# EAGLE design DrMcn (EAGLE 8.2.2)

## Sheet 1 of 2: power
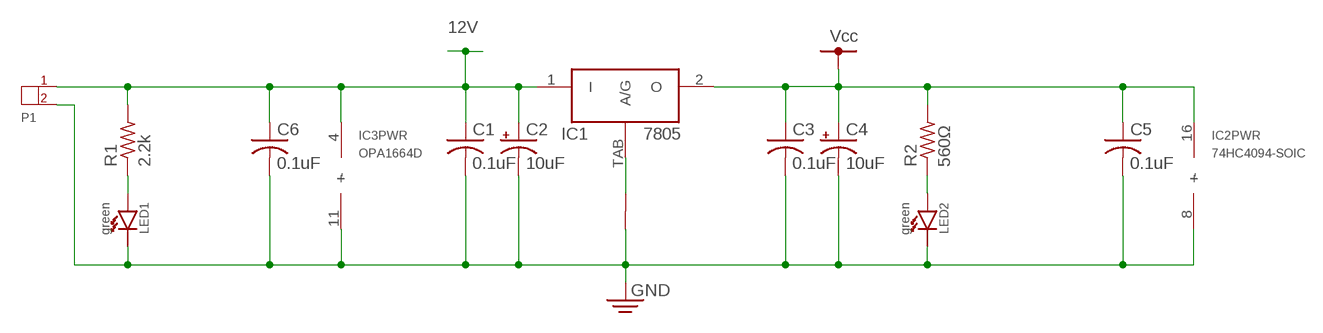
[diagram p0: schematic, sheet 1]

### Parts
-1  SEPERATOR  [SEPERATOR]
C1  0.1uF  C-USC0805  [C0805]
C2  10uF  CPOL-USE5-10.5  [E5-10,5]
C3  0.1uF  C-USC0805  [C0805]
C4  10uF  CPOL-USE5-10.5  [E5-10,5]
C5  0.1uF  C-USC0805  [C0805]
C6  0.1uF  C-USC0805  [C0805]
IC1  7805  [TO-252]
IC2  74HC4094-SOIC  [16-SOIC]
IC3  OPA1664D  [14-SOP]
LED1  green  LG_Q971  [0603-LED]
LED2  green  LG_Q971  [0603-LED]
P1  CONN-2P-VL  [B02P-VL]
R1  2.2k  R-US_R0805  [R0805]
R2  560Ω  R-US_R0603  [R0603]

### Nets
12V [mm]: C1.1 C2.+ C6.1 IC1.1(I) IC3.4(PWR:+) P1.1 R1.2 ; also sheet 2
GND: -1.P$1 C1.2 C2.- C3.2 C4.- C5.2 C6.2 IC2.8(PWR:-) IC3.11(PWR:-) LED1.C LED2.C P1.2 ; also sheet 2
N$1: LED2.A R2.1
N$2: LED1.A R1.1
TAB: -1.P$2 IC1.TAB(A/G)
VCC [Vcc]: C3.1 C4.+ C5.1 IC1.2(O) IC2.16(PWR:+) R2.2 ; also sheet 2

## Sheet 2 of 2: control
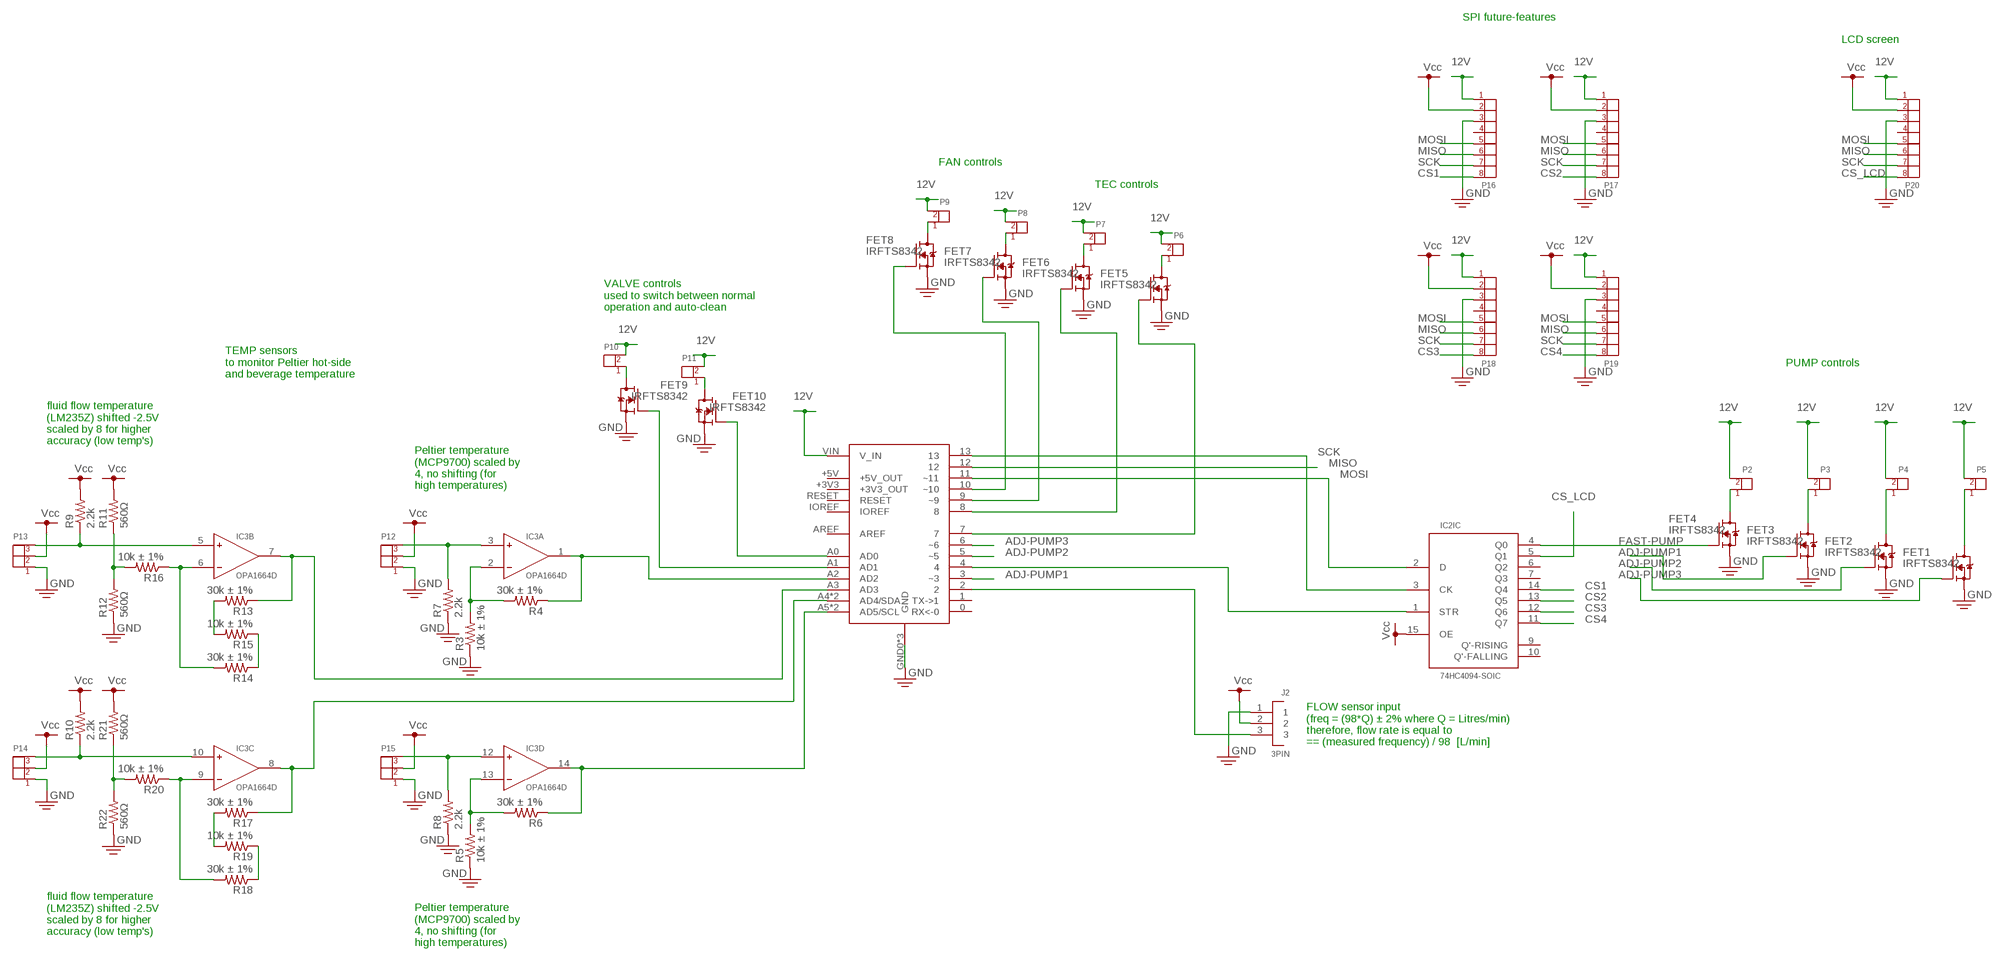
[diagram p1: schematic, sheet 2]

### Parts
FET1  IRFTS8342  [SOT23-6]
FET2  IRFTS8342  [SOT23-6]
FET3  IRFTS8342  [SOT23-6]
FET4  IRFTS8342  [SOT23-6]
FET5  IRFTS8342  [SOT23-6]
FET6  IRFTS8342  [SOT23-6]
FET7  IRFTS8342  [SOT23-6]
FET8  IRFTS8342  [SOT23-6]
FET9  IRFTS8342  [SOT23-6]
FET10  IRFTS8342  [SOT23-6]
J1  ARDUINO_UNO  [ARDUINO_UNO]
J2  3PIN  [3P]
P2  CONN-2P-PNI  [B02B-PNISK]
P3  CONN-2P-PNI  [B02B-PNISK]
P4  CONN-2P-PNI  [B02B-PNISK]
P5  CONN-2P-PNI  [B02B-PNISK]
P6  CONN-2P-VL  [B02P-VL]
P7  CONN-2P-VL  [B02P-VL]
P8  CONN-2P-PNI  [B02B-PNISK]
P9  CONN-2P-PNI  [B02B-PNISK]
P10  CONN-2P-PNI  [B02B-PNISK]
P11  CONN-2P-PNI  [B02B-PNISK]
P12  CONN-3P-PNI  [B03B-PNISK]
P13  CONN-3P-PNI  [B03B-PNISK]
P14  CONN-3P-PNI  [B03B-PNISK]
P15  CONN-3P-PNI  [B03B-PNISK]
P16  CONN-8P-PND  [B08B-PND]
P17  CONN-8P-PND  [B08B-PND]
P18  CONN-8P-PND  [B08B-PND]
P19  CONN-8P-PND  [B08B-PND]
P20  CONN-8P-PND  [B08B-PND]
R3  10k ± 1%  R-US_R0603  [R0603]
R4  30k ± 1%  R-US_R0603  [R0603]
R5  10k ± 1%  R-US_R0603  [R0603]
R6  30k ± 1%  R-US_R0603  [R0603]
R7  2.2k  R-US_R0603  [R0603]
R8  2.2k  R-US_R0603  [R0603]
R9  2.2k  R-US_R0603  [R0603]
R10  2.2k  R-US_R0603  [R0603]
R11  560Ω  R-US_R0603  [R0603]
R12  560Ω  R-US_R0603  [R0603]
R13  30k ± 1%  R-US_R0603  [R0603]
R14  30k ± 1%  R-US_R0603  [R0603]
R15  10k ± 1%  R-US_R0603  [R0603]
R16  10k ± 1%  R-US_R0603  [R0603]
R17  30k ± 1%  R-US_R0603  [R0603]
R18  30k ± 1%  R-US_R0603  [R0603]
R19  10k ± 1%  R-US_R0603  [R0603]
R20  10k ± 1%  R-US_R0603  [R0603]
R21  560Ω  R-US_R0603  [R0603]
R22  560Ω  R-US_R0603  [R0603]

### Nets
12V [mm]: J1.VIN(V_IN) P2.2 P3.2 P4.2 P5.2 P6.2 P7.2 P8.2 P9.2 P10.2 P11.2 P16.1 P17.1 P18.1 P19.1 P20.1 ; also sheet 1
ADJ-PUMP1: FET3.3(G) J1.3(~3)
ADJ-PUMP2: FET2.3(G) J1.5(~5)
ADJ-PUMP3: FET1.3(G) J1.6(~6)
CS1: IC2.14(IC:Q4) P16.8
CS2: IC2.13(IC:Q5) P17.8
CS3: IC2.12(IC:Q6) P18.8
CS4: IC2.11(IC:Q7) P19.8
CS_LCD: IC2.5(IC:Q1) P20.8
FAST-PUMP: FET4.3(G) IC2.4(IC:Q0)
GND: FET1.4(S) FET2.4(S) FET3.4(S) FET4.4(S) FET5.4(S) FET6.4(S) FET7.4(S) FET8.4(S) FET9.4(S) FET10.4(S) J1.GND0(GND) J1.GND1(GND) J1.GND2(GND) J2.1 P12.1 P13.1 P14.1 P15.1 P16.3 P17.3 P18.3 P19.3 P20.3 R3.1 R5.1 R7.1 R8.1 R12.1 R22.1 ; also sheet 1
MISO: J1.12 P16.6 P17.6 P18.6 P19.6 P20.6
MOSI: IC2.2(IC:D) J1.11(~11) P16.5 P17.5 P18.5 P19.5 P20.5
N$3: IC3.7(B:OUT) J1.A3(AD3) R13.1
N$4: IC3.10(C:+) P14.3 R10.1
N$5: IC3.2(A:-) R3.2 R4.2
N$6: IC3.1(A:OUT) J1.A2(AD2) R4.1
N$7 [mm]: FET4.1(D) FET4.2(D) FET4.5(D) FET4.6(D) P2.1
N$8 [mm]: FET3.1(D) FET3.2(D) FET3.5(D) FET3.6(D) P3.1
N$9 [mm]: FET2.1(D) FET2.2(D) FET2.5(D) FET2.6(D) P4.1
N$10 [mm]: FET1.1(D) FET1.2(D) FET1.5(D) FET1.6(D) P5.1
N$11: FET7.3(G) J1.9(~9)
N$12: J1.2 J2.3
N$13 [mm]: FET9.1(D) FET9.2(D) FET9.5(D) FET9.6(D) P10.1
N$14 [mm]: FET5.1(D) FET5.2(D) FET5.5(D) FET5.6(D) P6.1
N$15 [mm]: FET10.1(D) FET10.2(D) FET10.5(D) FET10.6(D) P11.1
N$16 [mm]: FET6.1(D) FET6.2(D) FET6.5(D) FET6.6(D) P7.1
N$17: FET7.1(D) FET7.2(D) FET7.5(D) FET7.6(D) P8.1
N$18: FET8.3(G) J1.10(~10)
N$19: FET8.1(D) FET8.2(D) FET8.5(D) FET8.6(D) P9.1
N$20: FET6.3(G) J1.8
N$21: FET5.3(G) J1.7
N$22: FET9.3(G) J1.A1(AD1)
N$23: FET10.3(G) J1.A0(AD0)
N$24: IC3.13(D:-) R5.2 R6.2
N$25: IC3.5(B:+) P13.3 R9.1
N$26: IC3.8(C:OUT) J1.A4(AD4/SDA) J1.SDA(AD4/SDA) R17.1
N$27: IC3.14(D:OUT) J1.A5(AD5/SCL) J1.SCL(AD5/SCL) R6.1
N$28: IC3.3(A:+) P12.3 R7.2
N$29: R11.1 R12.2 R16.2
N$30: IC2.1(IC:STR) J1.4
N$31: IC3.12(D:+) P15.3 R8.2
N$32: IC3.6(B:-) R14.2 R16.1
N$33: IC3.9(C:-) R18.2 R20.1
N$34: R20.2 R21.1 R22.2
N$36: R13.2 R15.2
N$37: R14.1 R15.1
N$39: R17.2 R19.2
N$40: R18.1 R19.1
SCK: IC2.3(IC:CK) J1.13 P16.7 P17.7 P18.7 P19.7 P20.7
VCC [Vcc]: IC2.15(IC:OE) J2.2 P12.2 P13.2 P14.2 P15.2 P16.2 P17.2 P18.2 P19.2 P20.2 R9.2 R10.2 R11.2 R21.2 ; also sheet 1
Unconnected: IC2.6(IC:Q2) IC2.7(IC:Q3) IC2.9(IC:Q'-RISING) IC2.10(IC:Q'-FALLING) J1.0(RX<-0) J1.1(TX->1) J1.+3V3(+3V3_OUT) J1.+5V(+5V_OUT) J1.AREF J1.IOREF J1.RESET P16.4 P17.4 P18.4 P19.4 P20.4

### Notes on the sheet
- SPI future-features
- LCD screen
- FAN controls
- TEC controls
- VALVE controls
  used to switch between normal
  operation and auto-clean
- PUMP controls
- TEMP sensors
  to monitor Peltier hot-side
  and beverage temperature
- fluid flow temperature
  (LM235Z) shifted -2.5V
  scaled by 8 for higher
  accuracy (low temp's)
- Peltier temperature
  (MCP9700) scaled by
  4, no shifting (for
  high temperatures)
- FLOW sensor input
  (freq = (98*Q) ± 2% where Q = Litres/min)
  therefore, flow rate is equal to
  == (measured frequency) / 98  [L/min]
- fluid flow temperature
  (LM235Z) shifted -2.5V
  scaled by 8 for higher
  accuracy (low temp's)
- Peltier temperature
  (MCP9700) scaled by
  4, no shifting (for
  high temperatures)

## Library data of the parts
-1 = Aaron SMT:SEPERATOR: seperates wide, hard-to-route power rails from thin supply traces
C1 C3 C5 C6 = rcl:C-US: CAPACITOR, American symbol
C2 C4 = rcl:CPOL-US: POLARIZED CAPACITOR, American symbol
FET1-FET10 = Aaron SMT:IRFTS8342
IC1 = Aaron SMT:7805: Voltage regulator, 5V 1A
IC2 = Aaron SMT:74HC4094: serial in / parallel out; shift register
IC3 = Aaron SMT:OPA1664: Low distortion with outputs >1Vpp
J1 = Aaron Header:ARDUINO_UNO: footprint for the header pins on most simple Arduino boards, such as the Uno and Duemilanove
J2 = Aaron Header:3PIN
LED1 LED2 = Aaron SMT:LG_Q971: 0603 LED; red, orange, yellow, or green
P1-P11 = Aaron:CONN-2P
P12-P15 = Aaron:CONN-3P
P16-P20 = Aaron:CONN-8P
R1-R22 = rcl:R-US_: RESISTOR, American symbol

## Net classes
0 default: width 0.375 mm, drill 0.5 mm, clearance 0.5 mm
1 mm: width 1 mm, drill 1.2 mm, clearance 0.5 mm
2 Vcc: width 0.6 mm, drill 0.5 mm

## Board
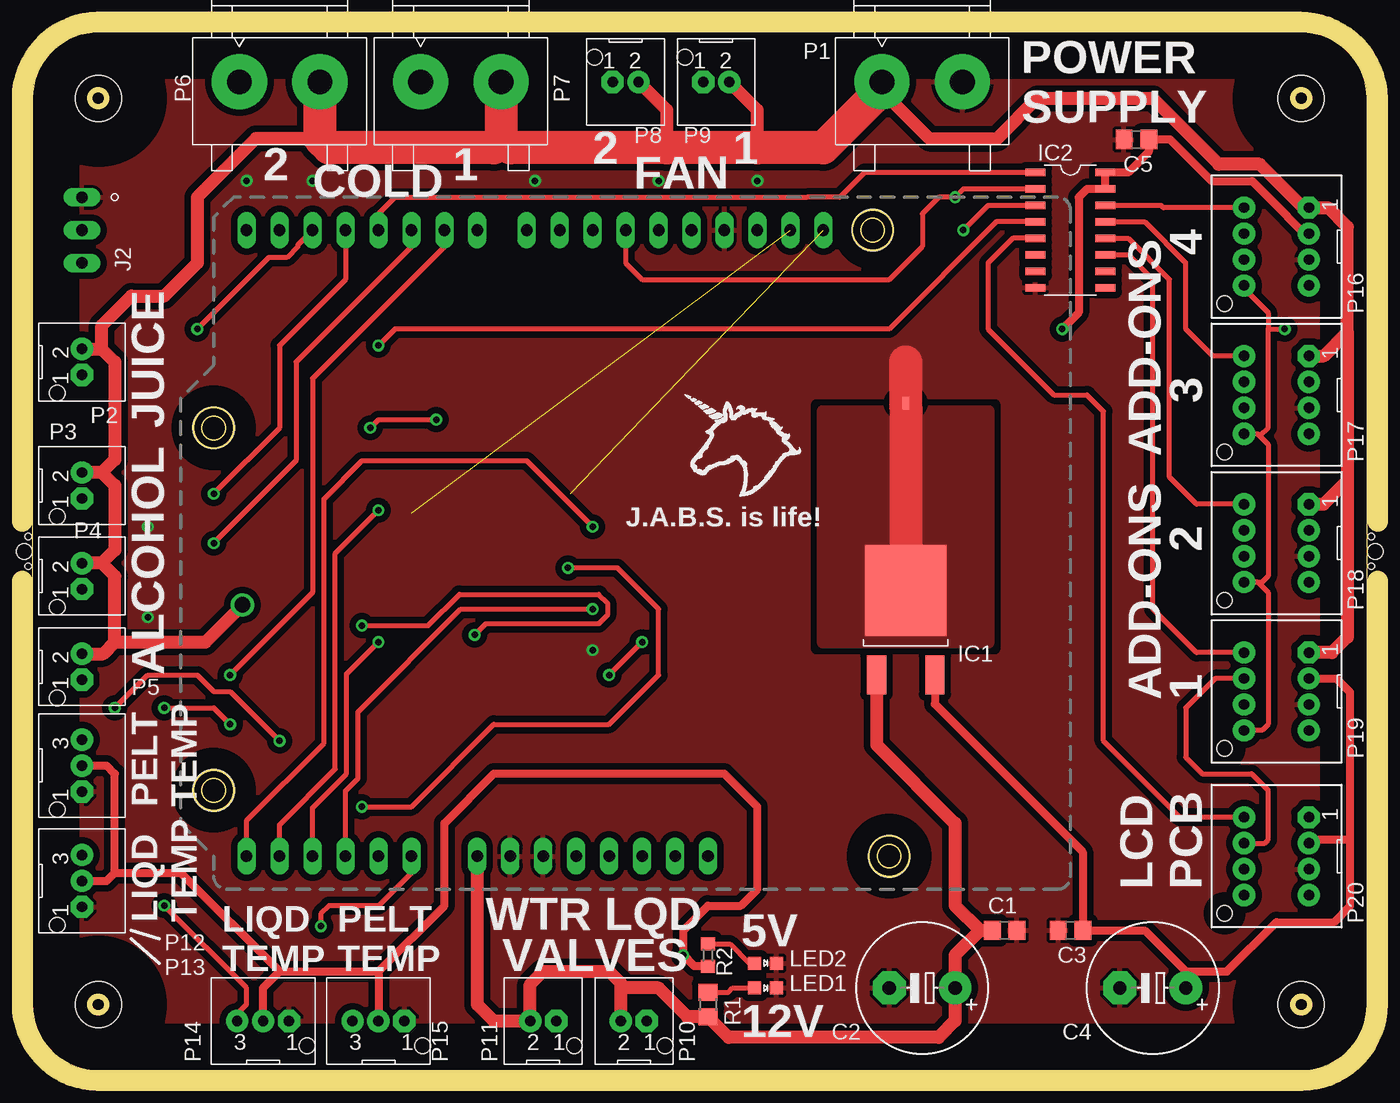
[diagram p2: board, top side]
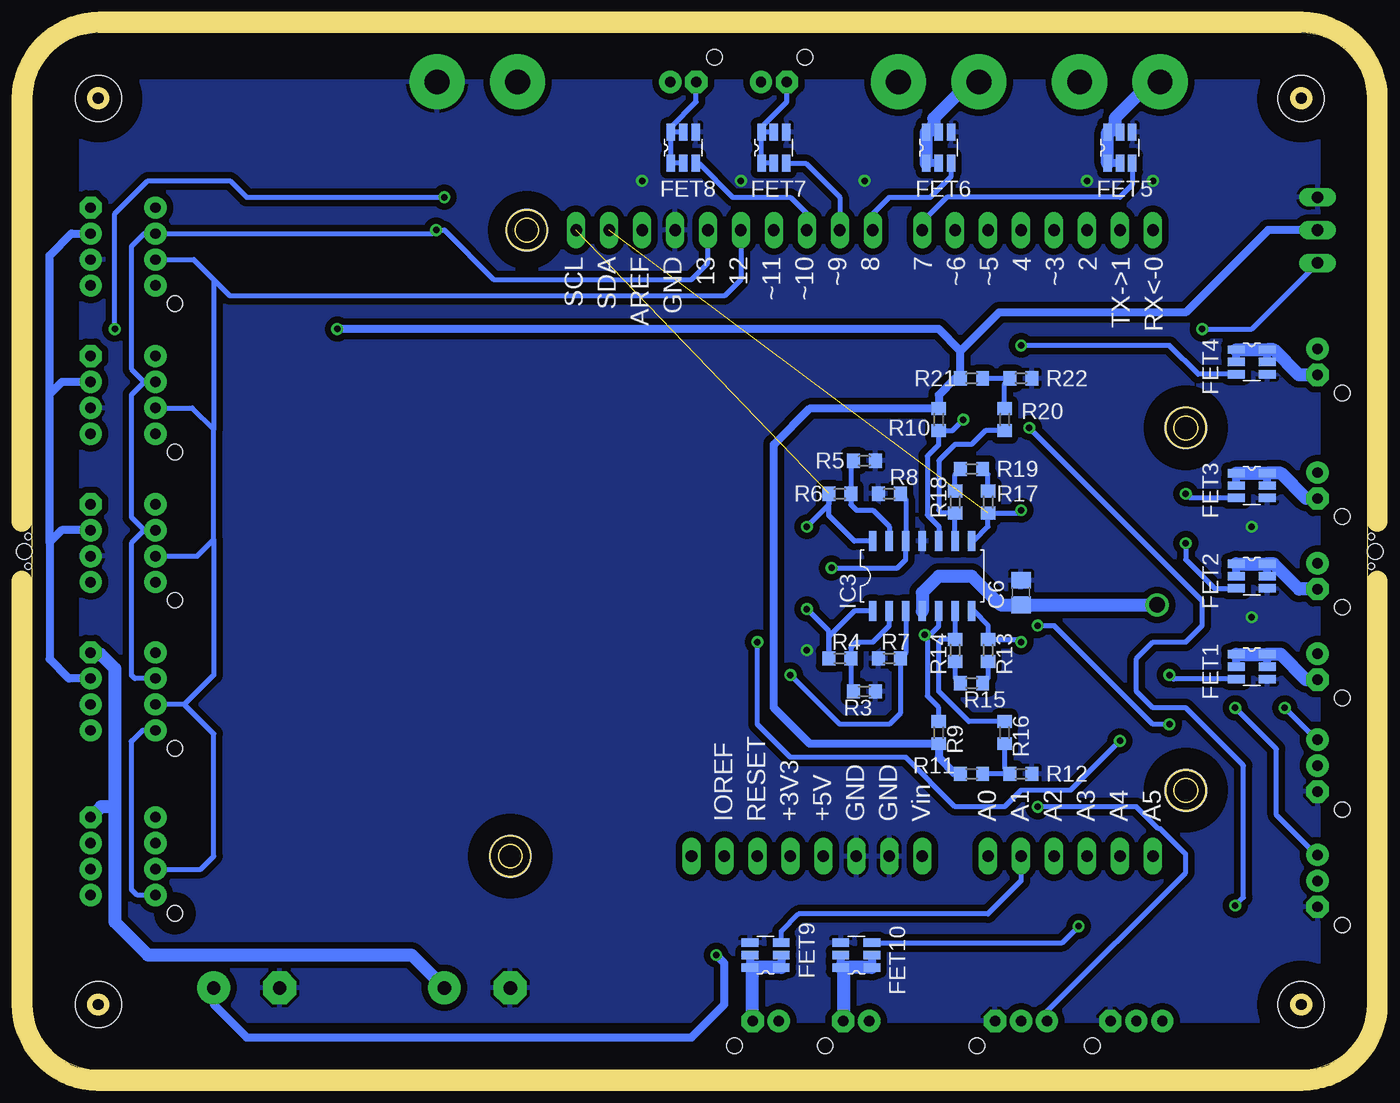
[diagram p3: board, bottom side, seen from below]

Size 102.87 x 80.01 mm. Coordinates in mm from the lower left corner, seen from the top.
Outline: 0,74.93 0,5.08 arc90 5.08,0 97.79,0 arc90 102.87,5.08 102.87,74.93 arc90 97.79,80.01 5.08,80.01 arc90 0,74.93
Copper layers (1*16): Top 0.035mm / dielectric 1.5mm / Bottom 0.035mm
Design rules "default": minimum track width 6mil, minimum drill 0.35mm, track to track 6mil, track to pad 6mil, pad to pad 6mil, via to via 6mil, smd to smd 6mil, copper to edge 40mil, drill to drill 6mil, minimum pad ring 10mil, minimum via ring 8mil, stop-mask expansion 4mil, vias tented up to drill 0mil, thermal gap 10mil
Holes 3.2 mm at 64.77,64.77 13.97,49.53 13.97,21.59 66.04,16.51
Holes 1.2 mm at 103.5,40.01 -0.64,40.01
Holes 0.5 mm at 103.19,38.86 103.19,41.15 -0.32,41.15 -0.32,38.86
tRestrict: area 10.8,18.4 to 17.1,24.8; area 10.8,46.4 to 17.1,52.7; area 62.9,13.3 to 69.2,19.7; area 61.8,61.8 to 67.7,67.7
bRestrict: area 10.8,18.4 to 17.1,24.8; area 10.8,46.4 to 17.1,52.7; area 62.9,13.3 to 69.2,19.7; area 61.8,61.8 to 67.7,67.7
Milling: 10 lines

### Footprints (pad centres in the part's own frame; a part is rotated, then mirrored left to right if it is on the bottom)
SEPERATOR = smd 0.5 x 0.5: P$1 -0.25,0; P$2 0.25,0
C0805 = smd 1.3 x 1.5: 1 -0.95,0; 2 0.95,0
E5-10,5 = drill 1.016 pad 2.54: + -2.54,0 | drill 1.016 pad 2.54 octagon: - 2.54,0
SOT23-6 = smd 0.65 x 1.3: 1 -0.95,-1.2; 2 0,-1.2; 3 0.95,-1.2; 4 0.95,1.2; 5 0,1.2; 6 -0.95,1.2
TO-252 = smd 1.5 x 3: 1 -2.25,0; 2 2.25,0 | smd 6.25 x 7: TAB 0,6.5
16-SOIC = smd 0.6 x 1.55: 1 -4.445,-2.7; 2 -3.175,-2.7; 3 -1.905,-2.7; 4 -0.635,-2.7; 5 0.635,-2.7; 6 1.905,-2.7; 7 3.175,-2.7; 8 4.445,-2.7; 9 4.445,2.7; 10 3.175,2.7; 11 1.905,2.7; 12 0.635,2.7; 13 -0.635,2.7; 14 -1.905,2.7; 15 -3.175,2.7; 16 -4.445,2.7
14-SOP = smd 0.6 x 1.55: 1 -3.81,-2.7; 2 -2.54,-2.7; 3 -1.27,-2.7; 4 0,-2.7; 5 1.27,-2.7; 6 2.54,-2.7; 7 3.81,-2.7; 8 3.81,2.7; 9 2.54,2.7; 10 1.27,2.7; 11 0,2.7; 12 -1.27,2.7; 13 -2.54,2.7; 14 -3.81,2.7
ARDUINO_UNO = drill 0.889 pad 1.422 long: 0 21.59,24.13; 1 19.05,24.13; 2 16.51,24.13; 3 13.97,24.13; 4 11.43,24.13; 5 8.89,24.13; 6 6.35,24.13; 7 3.81,24.13; 8 0,24.13; 9 -2.54,24.13; 10 -5.08,24.13; 11 -7.62,24.13; 12 -10.16,24.13; 13 -12.7,24.13; 20 -13.97,-24.13; +3V3 -6.35,-24.13; +5V -3.81,-24.13; A0 8.89,-24.13; A1 11.43,-24.13; A2 13.97,-24.13; A3 16.51,-24.13; A4 19.05,-24.13; A5 21.59,-24.13; AREF -17.78,24.13; GND0 -15.24,24.13; GND1 1.27,-24.13; GND2 -1.27,-24.13; IOREF -11.43,-24.13; RESET -8.89,-24.13; SCL -22.86,24.13; SDA -20.32,24.13; VIN 3.81,-24.13
3P = drill 0.889 pad 1.422 long: 1 -2.54,0; 2 0,0; 3 2.54,0
0603-LED = smd 1 x 1: A -0.85,0; C 0.85,0
B02P-VL = drill 1.9 pad 4.25: 1 3.1,0; 2 -3.1,0
B02B-PNISK = drill 0.8 pad 1.714 octagon: 1 1,0 | drill 0.8 pad 1.714: 2 -1,0 | hole 1.2: 2.4,-1.9
B03B-PNISK = drill 0.8 pad 1.714 octagon: 1 2,0 | drill 0.8 pad 1.714: 2 0,0; 3 -2,0 | hole 1.2: 3.4,-1.9
B08B-PND = drill 0.8 pad 1.714 octagon: 1 3,-2.5 | drill 0.8 pad 1.714: 2 1,-2.5; 3 -1,-2.5; 4 -3,-2.5; 5 -3,2.5; 6 -1,2.5; 7 1,2.5; 8 3,2.5 | hole 1.2: -4.4,4
R0805 = smd 1.3 x 1.5: 1 -0.95,0; 2 0.95,0
R0603 = smd 1 x 1.1: 1 -0.85,0; 2 0.85,0
#6-32 = hole 3.556: 0,0

### Placement (x,y rotation side)
-1  67.31,51.44 270 top
C1  74.93,10.79 0 top
C2  68.58,6.35 180 top
C3  80.01,10.79 180 top
C4  86.36,6.35 180 top
C5  85.09,71.75 180 top
C6  26.67,36.83 90 bottom
FET1  8.89,31.11 270 bottom
FET2  8.89,38.1 270 bottom
FET3  8.89,45.09 270 bottom
FET4  8.89,54.61 270 bottom
FET5  19.05,71.12 0 bottom
FET6  33.02,71.12 0 bottom
FET7  45.72,71.12 0 bottom
FET8  52.7,71.12 0 bottom
FET9  46.35,8.89 90 bottom
FET10  39.37,8.89 90 bottom
IC1  67.31,30.48 0 top
IC2  80.01,64.77 270 top
IC3  34.29,38.1 0 bottom
J1  38.1,40.64 0 bottom
J2  3.81,64.77 270 top
LED1  56.52,6.35 0 top
LED2  56.52,8.26 0 top
P1  68.58,76.2 180 top
P2  3.81,54.61 270 top
P3  3.81,45.09 270 top
P4  3.81,38.1 270 top
P5  3.81,31.11 270 top
P6  19.05,76.2 180 top
P7  33.02,76.2 180 top
P8  45.72,76.2 180 top
P9  52.7,76.2 180 top
P10  46.35,3.81 0 top
P11  39.37,3.81 0 top
P12  3.81,23.5 270 top
P13  3.81,14.61 270 top
P14  17.78,3.81 0 top
P15  26.67,3.81 0 top
P16  95.89,63.5 90 top
P17  95.89,52.07 90 top
P18  95.89,40.64 90 top
P19  95.89,29.21 90 top
P20  95.89,16.51 90 top
R1  52.07,5.08 270 top
R2  52.07,8.89 270 top
R3  38.73,29.21 180 bottom
R4  40.64,31.75 0 bottom
R5  38.73,46.99 180 bottom
R6  40.64,44.45 0 bottom
R7  36.83,31.75 0 bottom
R8  36.83,44.45 0 bottom
R9  33.02,26.04 270 bottom
R10  33.02,50.16 90 bottom
R11  30.48,22.86 180 bottom
R12  26.67,22.86 180 bottom
R13  29.21,32.38 270 bottom
R14  31.75,32.38 90 bottom
R15  30.48,29.84 0 bottom
R16  27.94,26.04 270 bottom
R17  29.21,43.81 90 bottom
R18  31.75,43.81 270 bottom
R19  30.48,46.35 0 bottom
R20  27.94,50.16 90 bottom
R21  30.48,53.34 180 bottom
R22  26.67,53.34 180 bottom
U$43  [#6-32]  97.79,74.93 0 top
U$44  [#6-32]  97.79,5.08 0 top
U$45  [#6-32]  5.08,5.08 0 top
U$46  [#6-32]  5.08,74.93 0 top
U$49  [UNICORN-SCREEN]  54.61,48.26 0 top
U$50  [JABS]  45.72,41.91 0 top

### Tracks (layer width: path | path; a pad name or v marks a point on that pad's centre or on a via)
12V  (via drill 1.2)
  Top 1: 48.9,71.12 48.9,74.03 P8.2 | 55.88,71.12 55.88,74.03 P9.2 | P5.2 5.45,32.12 6.35,33.02 | 5.35,39.1 P4.2 | 5.35,39.1 6.35,38.1 6.35,33.02 | 5.35,46.09 P3.2 | 5.35,46.09 6.35,45.09 6.35,40.1 5.35,39.1 | P2.2 5.35,55.61 | 5.35,55.61 6.35,54.61 6.35,47.09 5.35,46.09 | 5.35,55.61 5.35,57.42 7.62,59.69 10.16,59.69 12.7,62.23 12.7,67.31 17.22,71.83 22.15,71.83 | P10.2 45.35,6.35 | J1.VIN 34.29,5.08 35.56,3.81 P11.2 38.37,6.62 39.37,7.62 44.45,7.62 45.35,6.71 45.35,6.35 | 98.42,66.54 P16.1 | P16.1 99.87,66.5 101.35,65.02 101.35,56.9 | P19.1 100.16,32.21 101.35,33.41 101.35,45.47 | 101.35,56.9 101.35,45.47 | P18.1 99.52,43.64 101.35,45.47 | P17.1 99.52,55.07 101.35,56.9 | 73.03,10.79 C1.1 | 73.03,10.79 71.12,8.89 C2.+ 71.12,3.81 69.85,2.54 53.66,2.54 R1.2 50.48,4.13 48.26,6.35 45.35,6.35 | IC1.1 65.06,25.11 71.12,19.05 71.12,12.7 73.03,10.79 | 65.48,75.64 65.33,75.64 69.14,71.83 74.37,71.83 77.47,74.93 86.36,74.93 91.44,69.85 94.61,69.85 97.97,66.5 P16.1 | 6.35,33.02 13.34,33.02 v16.2,35.88
  Top 2.54: P6.2 22.15,71.83 22.86,71.12 35.56,71.12 36.12,71.68 | P7.2 36.12,71.68 | 36.12,71.68 36.27,71.68 36.83,71.12 48.9,71.12 55.88,71.12 60.96,71.12 65.48,75.64 P1.1
  Bottom 1: IC3.4 34.29,36.83 33.02,38.1 30.48,38.1 28.26,35.88 C6.1 v16.2,35.88 | P19.1 98.24,32.07 97.62,32.07 96.53,30.98 96.53,20.32 | 96.53,20.32 96.53,11.44 93.98,8.89 73.66,8.89 C2.+ | 96.53,20.32 97.58,20.32 P20.1
ADJ-PUMP1  (via drill 0.5)
  Top 0.375: J1.3 24.13,60.96 19.05,55.88 19.05,49.53 v13.97,44.45
  Bottom 0.375: FET3.3 13.65,44.13 v13.97,44.45
ADJ-PUMP2  (via drill 0.5)
  Top 0.375: J1.5 29.21,63.5 20.32,54.61 20.32,46.99 v13.97,40.64
  Bottom 0.375: FET2.3 11.75,37.15 13.97,39.37 v13.97,40.64
ADJ-PUMP3  (via drill 0.5)
  Top 0.375: J1.6 31.75,63.5 21.59,53.34 21.59,36.83 v15.24,30.48
  Bottom 0.375: FET1.3 14.93,30.16 v15.24,30.48
CS1
  Top 0.375: IC2.14 87,66.67 87.17,66.5 P16.8
CS2
  Top 0.375: IC2.13 85.72,65.41 88.9,62.23 88.9,57.15 90.98,55.07 P17.8
CS3
  Top 0.375: IC2.12 84.45,64.14 87.63,60.96 87.63,45.72 89.71,43.64 P18.8
CS4
  Top 0.375: IC2.11 84.45,62.87 86.36,60.96 86.36,35.56 89.71,32.21 P19.8
CS_LCD
  Top 0.375: IC2.5 75.56,64.14 73.66,62.23 73.66,57.15 78.74,52.07 81.28,52.07 82.55,50.8 82.55,25.4 88.44,19.51 P20.8
FAST-PUMP  (via drill 0.5)
  Top 0.375: IC2.4 74.3,65.41 66.04,57.15 27.94,57.15 v26.67,55.88
  Bottom 0.375: v26.67,55.88 15.24,55.88 13.02,53.66 FET4.3
GND  (via drill 0.5)
  Top 2.54: -1.P$1 67.31,54.61
  other vias: 16.51,68.58 21.59,68.58 38.73,68.58 48.26,68.58 55.88,68.58 8.89,41.91 8.89,34.92 43.18,32.38
  pour Bottom: 3.81,76.2 3.81,3.81 99.06,3.81 99.06,76.2
  pour Top (rank 2): 3.81,76.2 3.81,3.81 99.06,3.81 99.06,76.2
MISO
  Bottom 0.375: 91.17,28.21 P19.6 | 88.9,60.96 88.9,49.43 | 88.9,40.91 88.9,49.43 | 88.9,40.91 88.9,30.48 91.17,28.21 | P16.6 90.44,62.5 88.9,60.96 | P17.6 90.54,51.07 88.9,49.43 | P18.6 90.17,39.64 88.9,40.91 | J1.12 48.26,60.96 49.53,59.69 87.63,59.69 88.9,60.96 | P20.6 89.9,15.51 88.9,16.51 88.9,25.94 91.17,28.21
MOSI  (via drill 0.5)
  Top 0.375: P19.5 94.79,26.21 95.25,26.67 95.25,36.83 94.44,37.64 P18.5 94.79,37.64 95.25,38.1 95.25,48.26 94.61,48.9 | P17.5 94.44,49.07 94.61,48.9 | 94.61,48.9 95.25,49.53 95.25,57.15 | P16.5 93.17,60.5 95.25,58.42 95.25,57.15 | IC2.2 71.75,67.94 v71.12,67.31 69.86,67.31 68.58,66.03 | 95.25,57.15 v96.52,57.15 | J1.11 45.72,62.23 46.99,60.96 66.04,60.96 68.58,63.5 68.58,66.03 | 68.58,66.03 68.58,66.04
  Bottom 0.375: v96.52,57.15 96.52,66.04 93.98,68.58 87.63,68.58 86.36,67.31 v71.12,67.31 | P20.5 94.79,13.51 95.25,13.97 95.25,25.33 | 95.25,25.33 95.25,25.4 | P19.5 94.37,26.21 95.25,25.33
N$1
  Top 0.375: LED2.A 55.24,8.26 53.76,9.74 R2.1
N$2
  Top 0.375: LED1.A 53.98,6.35 53.66,6.03 R1.1
N$3  (via drill 0.5)
  Top 0.375: v26.67,33.02 24.21,30.57 24.21,22.87 21.59,20.24 J1.A3
  Bottom 0.375: IC3.7 30.32,35.4 29.21,34.29 R13.1 26.89,33.23 v26.67,33.02
N$4  (via drill 0.5)
  Top 0.375: v10.16,12.7 16.51,6.35 16.51,5.08 15.24,3.81 P14.3 | v31.11,50.16 26.67,50.16 v26.04,49.53
  Bottom 0.375: IC3.10 33.02,41.94 33.9,42.82 33.9,47.35 33.02,48.23 R10.1 31.96,49.31 v31.11,50.16 | v10.16,12.7 9.53,13.34 9.53,23.5 13.97,27.94 16.51,27.94 17.78,29.21 17.78,31.75 16.51,33.02 13.97,33.02 12.7,34.29 12.7,36.2 v26.04,49.53
N$5
  Bottom 0.375: IC3.2 36.83,34.29 38.1,33.02 39.37,33.02 39.79,32.6 R4.2 39.79,29.41 R3.2
N$6  (via drill 0.5)
  Top 0.375: J1.A2 24.13,21.55 25.09,22.51 25.09,27.63 33.02,35.56 v43.18,35.56
  Bottom 0.375: IC3.1 39.53,35.4 41.49,33.44 R4.1 41.49,33.87 v43.18,35.56
N$7
  Bottom 0.635: FET4.2 FET4.1 | FET4.5 FET4.6
  Bottom 1: FET4.1 FET4.6 7.2,55.56 5.25,53.61 P2.1
N$8
  Bottom 0.635: FET3.2 FET3.1 | FET3.5 FET3.6
  Bottom 1: FET3.1 FET3.6 6.67,46.03 4.71,44.09 P3.1
N$9
  Bottom 0.635: FET2.2 FET2.1 | FET2.5 FET2.6
  Bottom 1: FET2.1 FET2.6 7.2,39.05 5.25,37.1 P4.1
N$10
  Bottom 0.635: FET1.2 FET1.1 | FET1.5 FET1.6
  Bottom 1: FET1.1 FET1.6 6.67,32.06 4.71,30.11 P5.1
N$11
  Bottom 0.375: FET7.3 43.25,69.92 40.64,67.31 J1.9
N$12  (via drill 0.5)
  Top 0.375: J1.2 20.45,63.63 20.45,63.48 19.63,62.66 18.21,62.66 v12.7,57.15
  Bottom 0.375: v12.7,57.15 8.89,57.15 J2.3
N$13
  Bottom 0.635: FET9.5 FET9.6 | FET9.2 FET9.1
  Bottom 1: FET9.1 FET9.6 47.35,7.74 P10.1
N$14
  Bottom 0.635: FET5.6 FET5.5 | FET5.2 FET5.1
  Bottom 1: FET5.1 FET5.6 19.43,72.89 19.43,73.38 16.61,76.2 P6.1
N$15
  Bottom 0.635: FET10.6 FET10.5 | FET10.2 FET10.1
  Bottom 1: P11.1 40.37,7.74 FET10.6 FET10.1
N$16
  Bottom 0.635: FET6.6 FET6.5 | FET6.2 FET6.1
  Bottom 1: FET6.1 FET6.6 33.4,72.89 33.4,73.38 30.58,76.2 P7.1
N$17
  Bottom 0.375: FET7.2 FET7.1 FET7.6 | FET7.5 FET7.6 | P8.1 44.72,74.66 46.67,72.71 FET7.6
N$18
  Bottom 0.375: FET8.3 51.51,69.92 48.9,67.31 44.45,67.31 43.18,66.04 J1.10
N$19
  Bottom 0.375: FET8.2 FET8.1 FET8.6 | FET8.5 FET8.6 | P9.1 51.7,74.66 53.66,72.71 FET8.6
N$20
  Bottom 0.375: FET6.3 32.07,68.89 33.66,67.31 36.83,67.31 38.1,66.04 J1.8
N$21
  Bottom 0.375: FET5.3 18.1,68.26 19.05,67.31 32.38,67.31 34.29,65.41 J1.7
N$22
  Bottom 0.375: FET9.3 45.16,10.72 43.81,12.06 29.21,12.06 26.67,14.61 J1.A1
N$23  (via drill 0.5)
  Top 0.375: v22.23,11.11 22.23,12.06 22.86,12.7 26.67,12.7 29.21,15.24 J1.A0
  Bottom 0.375: v22.23,11.11 23.5,9.84 FET10.3
N$24
  Bottom 0.375: R5.2 39.79,46.78 R6.2 39.79,43.6 39.37,43.18 38.1,43.18 36.83,41.91 IC3.13
N$25  (via drill 0.5)
  Top 0.375: v15.24,26.67 13.97,27.94 v10.16,27.94 | v25.4,34.29 30.51,34.29 32.92,36.7 43.65,36.7 44.32,36.03 44.32,35.09 43.65,34.42 34.93,34.42 v34.08,33.57
  Bottom 0.375: R9.1 33.02,27.97 33.9,28.85 33.9,33.18 | 33.9,33.18 33.9,33.38 33.02,34.26 IC3.5 | v25.4,34.29 24.13,34.29 16.51,26.67 v15.24,26.67 | v10.16,27.94 6.99,24.77 6.99,19.68 3.81,16.51 P13.3 | v34.08,33.57 34.08,33.37 33.9,33.18
N$26  (via drill 0.5)  (1 unrouted)
  Top 0.375: v26.67,43.18 23.34,39.85 23.34,23.23 19.05,18.94 J1.A4
  Bottom 0.375: IC3.8 30.32,40.8 29.21,41.91 R17.1 26.89,42.97 v26.67,43.18
N$27  (via drill 0.5)  (1 unrouted)
  Top 0.375: J1.A5 16.51,19.27 22.46,25.22 22.46,44.05 25.4,46.99 38.1,46.99 v43.18,41.91
  Bottom 0.375: IC3.14 39.53,40.8 41.49,42.76 R6.1 41.49,43.6 v43.18,41.91
N$28  (via drill 0.5)
  Top 0.375: v46.99,33.02 v44.45,30.48 | v19.05,25.4 15.24,29.21 13.97,29.21 12.7,30.48 8.89,30.48 v6.35,27.94
  Bottom 0.375: IC3.3 35.56,32.17 R7.2 35.98,27.52 36.83,26.67 40.64,26.67 v44.45,30.48 | v46.99,33.02 46.99,26.67 44.45,24.13 35.56,24.13 31.75,20.32 27.94,20.32 26.67,21.59 22.86,21.59 v19.05,25.4 | v6.35,27.94 3.81,25.4 P12.3
N$29
  Bottom 0.375: R11.1 R12.2 27.94,23.28 R16.2
N$30
  Top 0.375: J1.4 26.67,66.04 27.94,67.31 59.69,67.31 62.23,67.31 64.14,69.22 IC2.1
N$31  (via drill 0.5)
  Top 0.375: v25.4,20.32 29.21,20.32 35.56,26.67 44.45,26.67 48.26,30.48 48.26,35.56 45.09,38.73 v41.27,38.73
  Bottom 0.375: R8.2 35.56,44.03 IC3.12 35.56,39.37 36.2,38.73 v41.27,38.73 | P15.3 24.67,4.54 13.97,15.24 13.97,16.66 15.93,18.62 16.08,18.62 17.78,20.32 v25.4,20.32
N$32
  Bottom 0.375: IC3.6 R14.2 32.8,33.23 33.02,33.02 33.02,29.21 30.7,26.89 R16.1
N$33
  Bottom 0.375: IC3.9 R18.2 32.8,42.97 33.02,43.18 33.02,46.99 31.75,48.26 30.48,48.26 29.43,49.31 R20.1
N$34
  Bottom 0.375: R21.1 R22.2 27.94,52.92 R20.2
N$36
  Bottom 0.375: R13.2 29.21,30.27 R15.2
N$37
  Bottom 0.375: R14.1 31.75,30.27 R15.1
N$39
  Bottom 0.375: R17.2 29.21,45.94 R19.2
N$40
  Bottom 0.375: R18.1 31.75,45.94 R19.1
SCK  (via drill 0.5)
  Top 0.375: IC2.3 73.66,66.67 v71.75,64.77 | P19.7 91.17,30.21 90.17,29.21 88.9,27.94 88.9,24.13 90.17,22.86 93.98,22.86 95.25,21.59 95.25,17.78 94.98,17.51 P20.7
  Bottom 0.375: P19.7 94.98,30.21 95.25,30.48 95.25,40.64 94.25,41.64 | 94.25,41.64 P18.7 | 94.25,53.07 P17.7 | 94.25,53.07 95.25,52.07 95.25,42.64 94.25,41.64 | 94.25,53.07 95.25,54.07 95.25,63.5 94.25,64.5 P16.7 72.03,64.5 v71.75,64.77 71.12,64.77 67.31,60.96 52.07,60.96 50.8,62.23 J1.13
TAB
  Top 2.54: -1.P$2 IC1.TAB
  pour Top (no thermals): 60.96,33.02 60.96,50.8 73.66,50.8 73.66,33.02
VCC  (via drill 0.5)
  Top 0.6: IC1.2 69.56,28.23 80.96,16.83 C3.1 85.72,10.79 88.9,7.62 | C4.+ 88.9,7.62 | 88.9,7.62 92.08,7.62 95.89,11.43 100.33,11.43 101.55,12.65 101.55,17.78 | 101.55,17.78 101.55,29.16 100.51,30.21 P19.2 | P16.2 98.04,64.84 97.7,64.84 96.73,65.81 96.73,65.83 94.01,68.55 90.9,68.55 87.7,71.75 C5.1 86.04,70.8 84.45,69.22 IC2.16 IC2.15 81.28,67.94 80.64,67.31 80.64,58.42 v79.38,57.15 | R2.2 51.02,8.04 v50.16,8.89 50.16,10.79 52.07,12.7 54.61,12.7 55.88,13.97 55.88,20.32 53.34,22.86 35.56,22.86 31.75,19.05 31.75,12.7 26.67,7.62 | 26.67,7.62 P15.2 | P14.2 17.78,6.35 19.05,7.62 | 19.05,7.62 26.67,7.62 | P12.2 5.71,23.5 6.35,22.86 6.35,15.24 | P13.2 5.71,14.61 6.35,15.24 | 6.35,15.24 11.43,15.24 19.05,7.62 | 101.55,17.78 98.66,17.78 P20.2
  Bottom 0.6: P19.2 100.06,30.21 101.55,31.7 101.55,40.72 | 101.55,52.12 101.55,62.82 99.87,64.5 P16.2 | 101.55,40.72 101.55,52.12 | P17.2 100.6,53.07 101.55,52.12 | P18.2 100.63,41.64 101.55,40.72 | v79.38,57.15 33.02,57.15 31.33,55.46 | 31.33,55.46 R21.2 31.75,53.34 33.02,52.07 R10.2 42.97,51.02 45.72,48.26 45.72,27.94 42.97,25.18 R9.2 33.02,24.13 31.75,22.86 R11.2 | J2.2 7.62,64.77 13.97,58.42 28.37,58.42 31.33,55.46 | C4.+ 88.9,5.08 86.36,2.54 52.07,2.54 49.53,5.08 49.53,8.26 v50.16,8.89

### Text on the board
tPlace: POWER / SUPPLY | 2 | 1 | 2 | 1 | FAN | COLD | 4 | 3 | JUICE | 2 | ALCOHOL | ADD-ONS ADD-ONS | 1 | PELT / TEMP | LCD / PCB | LIQD / TEMP | WTR LQD | 5V | LIQD / TEMP | PELT / TEMP | VALVES | 12V